# Altium schematic sheet 4_Digital_Isolator.SchDoc: Digital_Isolator
size A4; ApprovedBy: Alcatraz; CheckedBy: Alcatraz; Author: Alcatraz; CompanyName: DHNLAB; DrawnBy: Alcatraz; Engineer: Alcatraz; Organization: DHNLAB PVT LTD; Address1: DHANBAD; Address2: JHARKHAND; Address3: INDIA; Address4: ASIA; DocumentNumber: 4; Revision: 1.0; SheetNumber: 4; SheetTotal: 7; ProjectTitle: USB-UART-ISO-CP2102
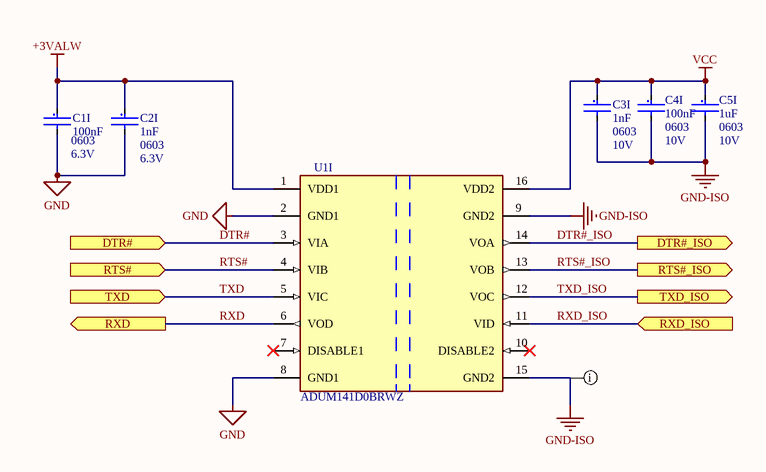
[diagram p0: 4_Digital_Isolator.SchDoc]

## Parts
C1I  value 100nF  Voltage: 6.3V  Package: 0603  [C0603-IPC_C_No_Silk]  (hidden comment: KGM15AR70J104KM)
C2I  value 1nF  Case Code (Imperial): 0603  Voltage Rating: 6.3V  [C0603-IPC_C_No_Silk]  (hidden comment: 06036A102KAT2A)
C3I  value 1nF  Case Code (Imperial): 0603  Voltage Rating: 10V  [C0603-IPC_C_No_Silk]  (hidden comment: CC0603KRX7R6BB102)
C4I  value 100nF  Voltage: 10V  Case/Package: 0603  [C0603-IPC_C_No_Silk]  (hidden comment: C0603C104K8RACTU)
C5I  value 1uF  Voltage: 10V  Case/Package: 0603  [C0603-IPC_C_No_Silk]  (hidden comment: C0603C105K8PACTU)
U1I  ADUM141D0BRWZ  [SOIC-W-16-IPC_A]

## Ports
DTR# (in), DTR#_ISO (out), RTS# (in), RTS#_ISO (out), RXD (out), RXD_ISO (in), TXD (in), TXD_ISO (out)

## Nets
+3VALW: C1I.1 C2I.1 U1I.1(VDD1)
GND: C1I.2 C2I.2 U1I.2(GND1) U1I.8(GND1)
GND-ISO: C3I.2 C4I.2 C5I.2 U1I.9(GND2) U1I.15(GND2)
VCC: C3I.1 C4I.1 C5I.1 U1I.16(VDD2)
DTR#: U1I.3(VIA) ; port DTR#
DTR#_ISO: U1I.14(VOA) ; port DTR#_ISO
RTS#: U1I.4(VIB) ; port RTS#
RTS#_ISO: U1I.13(VOB) ; port RTS#_ISO
RXD: U1I.6(VOD) ; port RXD
RXD_ISO: U1I.11(VID) ; port RXD_ISO
TXD: U1I.5(VIC) ; port TXD
TXD_ISO: U1I.12(VOC) ; port TXD_ISO

Not connected (* = marked no-connect by the designer): U1I 7(DISABLE1)* 10(DISABLE2)*

## Layout directives
net class GND; net class PowerRails_GND: GND-ISO

## Notes on the sheet
- Title:
- Author:
- Approved:
- Size:
- Date:
- Git Hash:
- A4
- Prj:
- SW Version:
- Variant:
- Edited:
- PUBLIC
- File:

## Library data of the parts
C1I = 100nF_6.3V: Cap Cer 0.1UF 6.3V X7R 0603; Manufacturer: KYOCERA AVX; Tol: 10%; Supplier 1: Digikey; Manufacturer Part Number: KGM15AR70J104KM; Category: Ceramic Capacitors; Stock 1: 117167; Pricing 1: 1=0.1, 10=0.032, 50=0.0186, 100=0.0144, 500=0.01082, 1000=0.0085, 2500=0.00772, 5000=0.00711 (USD); Supplier Part Number 1: 478-KGM15AR70J104KMCT-ND
C2I = 1nF_6.3V: Cap Ceramic 0.001uF 6.3V C0G 10% SMD 0603 125°C Paper T/R; Manufacturer: Kyocera AVX; Supplier 1: Avnet; Manufacturer Part Number: 06036A102KAT2A; RoHS: Yes; Category: Ceramic Capacitors; Mounting Technology: Surface Mount; Case/Package: 0603; Pins: 2; Case Code (Metric): 1608; Min Operating Temperature: -55°C; Max Operating Temperature: 125°C; Packaging: Tape and Reel; Tolerance: 10%; Package Quantity: 4000; Voltage Rating (DC): 6.3V; Dielectric: C0G; Termination: SMD/SMT; Series: -; Construction: Flat; Length: 1.6mm; Width: 0.032inch; Depth: 0.81mm; Thickness: 0.035inch; RoHS Compliant: Yes; ComponentLink1URL: https://datasheet.ciiva.com/6265/ccog-6265066.pdf?src-supplier=Digikey; ComponentLink1Description: https://datasheet.ciiva.com/6265/ccog-6265066.pdf?src-supplier=Digikey; Supplier Part Number 1: 06036A102KAT2A
C3I = 1nF_10V: Cap Ceramic 0.001uF 10V X7R 10% SMD 0603 125°C Paper T/R; Manufacturer: Yageo; Supplier 1: Future Electronics; Manufacturer Part Number: CC0603KRX7R6BB102; RoHS: Yes; Category: Ceramic Capacitors; Mounting Technology: Surface Mount; Case/Package: 0603; Case Code (Metric): 1608; Min Operating Temperature: -55°C; Max Operating Temperature: 125°C; Packaging: Tape and Reel; Tolerance: 10%; Voltage Rating (DC): 10V; Dielectric: X7R; Termination: Wraparound; Series: CC; Construction: Flat; Length: 0.063inch; Width: 0.031inch; Thickness: 0.035inch; RoHS Compliant: Yes; ComponentLink1URL: https://datasheet.ciiva.com/13210/upy-gphc-x7r-6-3v-to-50v-8-12304-13210264.pdf?src-supplier=Mouser; ComponentLink1Description: https://datasheet.ciiva.com/13210/upy-gphc-x7r-6-3v-to-50v-8-12304-13210264.pdf?src-supplier=Mouser; Supplier Part Number 1: 6091492; Stock 1: 16000; Pricing 1: 4000=0.0036, 16000=0.0035, 80000=0.0033, 160000=0.0033, 500000=0.0031 (USD); Height: 0.8mm; Lead Free: Lead Free; Halogen Free: Halogen Free
C4I = 100nF_10V: Multilayer Ceramic Capacitor, 0.1 uF, 10 V, ± 10%, X7R, 0603 [1608 Metric]; Manufacturer: KEMET; Material: 4241ConductorMaterial; Dissipation Factor: 5%; Temperature Coefficient: 30ppm/°C; Supplier 1: Mouser; Manufacturer Part Number: C0603C104K8RACTU; Category: Ceramic Capacitors; Stock 1: 246409; Pricing 1: 1=0.11, 10=0.075, 50=0.075, 100=0.036, 1000=0.021, 10000=0.017 (USD); Supplier Part Number 1: 80-C0603C104K8R; RoHS: Yes; Mounting Technology: Surface Mount,PCB; Pins: 2; Case Code (Imperial): 0603; Case Code (Metric): 1608; Dielectric Material: Ceramic; Min Operating Temperature: -55°C; Max Operating Temperature: 125°C; Tolerance: 10%; Voltage Rating: 10V; Packaging: Tape and Reel; Dielectric: X7R; Series: C; Package Quantity: 1; Termination: SMD/SMT; Construction: Flat; Length: 1.6mm; Width: 0.031inch; Height: 0.8mm; Thickness: 0.034inch; Lead Pitch: 0.7mm; Depth: 0.8mm; Radiation Hardening: No; Reach SVHC Compliant: No; RoHS Compliant: Yes; Lead Free: 5697LeadFree; ComponentLink1URL: https://datasheet.ciiva.com/6093/1776114-6093269.pdf?src-supplier=Farnell; ComponentLink1Description: https://datasheet.ciiva.com/6093/1776114-6093269.pdf?src-supplier=Farnell; ComponentLink2URL: https://datasheet.ciiva.com/7823/kem-c1002-x7r-smd-7823989.pdf?src-supplier=Element14; ComponentLink2Description: https://datasheet.ciiva.com/7823/kem-c1002-x7r-smd-7823989.pdf?src-supplier=Element14; ComponentLink3URL: https://datasheet.ciiva.com/22693/1851736-22693967.pdf?src-supplier=Element14; ComponentLink3Description: https://datasheet.ciiva.com/22693/1851736-22693967.pdf?src-supplier=Element14; ComponentLink4URL: https://datasheet.ciiva.com/14589/70095383-14589402.pdf?src-supplier=Allied+Electronics; ComponentLink4Description: https://datasheet.ciiva.com/14589/70095383-14589402.pdf?src-supplier=Allied+Electronics; ComponentLink5URL: https://datasheet.ciiva.com/14593/70095383-14593978.pdf?src-supplier=Allied+Electronics; ComponentLink5Description: https://datasheet.ciiva.com/14593/70095383-14593978.pdf?src-supplier=Allied+Electronics; ComponentLink6URL: https://datasheet.ciiva.com/5419/kem-c1002-x7r-smd-357932-5419657.pdf?src-supplier=Mouser; ComponentLink6Description: https://datasheet.ciiva.com/5419/kem-c1002-x7r-smd-357932-5419657.pdf?src-supplier=Mouser; ComponentLink7URL: https://datasheet.ciiva.com/18192/getdatasheetpartid-91529-18192711.pdf?src-supplier=Verical; ComponentLink7Description: https://datasheet.ciiva.com/18192/getdatasheetpartid-91529-18192711.pdf?src-supplier=Verical; Voltage Rating (DC): 10V
C5I = 1uF_10V: Ceramic Capacitor, Multilayer, Ceramic, 10V, 10% +Tol, 10% -Tol, X5R, 15% TC, 1uF, 0603; Manufacturer: KEMET; Supplier 1: Mouser; Manufacturer Part Number: C0603C105K8PACTU; Category: Ceramic Capacitors; Stock 1: 221942; Pricing 1: 1=0.1, 10=0.03, 50=0.03, 100=0.018, 1000=0.014, 10000=0.009 (USD); RoHS: Yes; Mounting Technology: Surface Mount; Pins: 2; Case Code (Imperial): 0603; Case Code (Metric): 1608; Dielectric Material: Ceramic; Min Operating Temperature: -55°C; Max Operating Temperature: 85°C; Tolerance: 10%; Voltage Rating: 10V; Packaging: Tape and Reel; Dielectric: X5R; Series: C; Package Quantity: 1; Termination: SMD/SMT; Construction: Flat; Length: 1.6mm; Width: 0.031inch; Height: 0.8mm; Thickness: 0.035inch; Depth: 0.8mm; Radiation Hardening: No; Reach SVHC Compliant: No; RoHS Compliant: Yes; Lead Free: 5697LeadFree; Voltage Rating (DC): 10V; Weight: 7.1E-05oz
U1I = ADUM141D0BRWZ: DGTL ISO 3750VRMS 4CH GP 16SOIC; Pulse Width Distortion (PWD): 3ns; Channel Type: Unidirectional; Min Supply Voltage: 1.7V; Max Supply Voltage: 5.5V; Propagation Delay: 13ns; Number of Channels: 4; Data Rate: 150Mbps; Isolated Power: No; Packaging: Rail/Tube; Number of Pins: 16; Case/Package: SOIC; Type: General Purpose; Lead Free: Contains Lead; Max Operating Temperature: 125°C; RoHS Compliant: Yes; Mount: Surface Mount; Min Operating Temperature: -40°C; REACH SVHC: No SVHC